# Altium project CommsBoard.PrjPcb
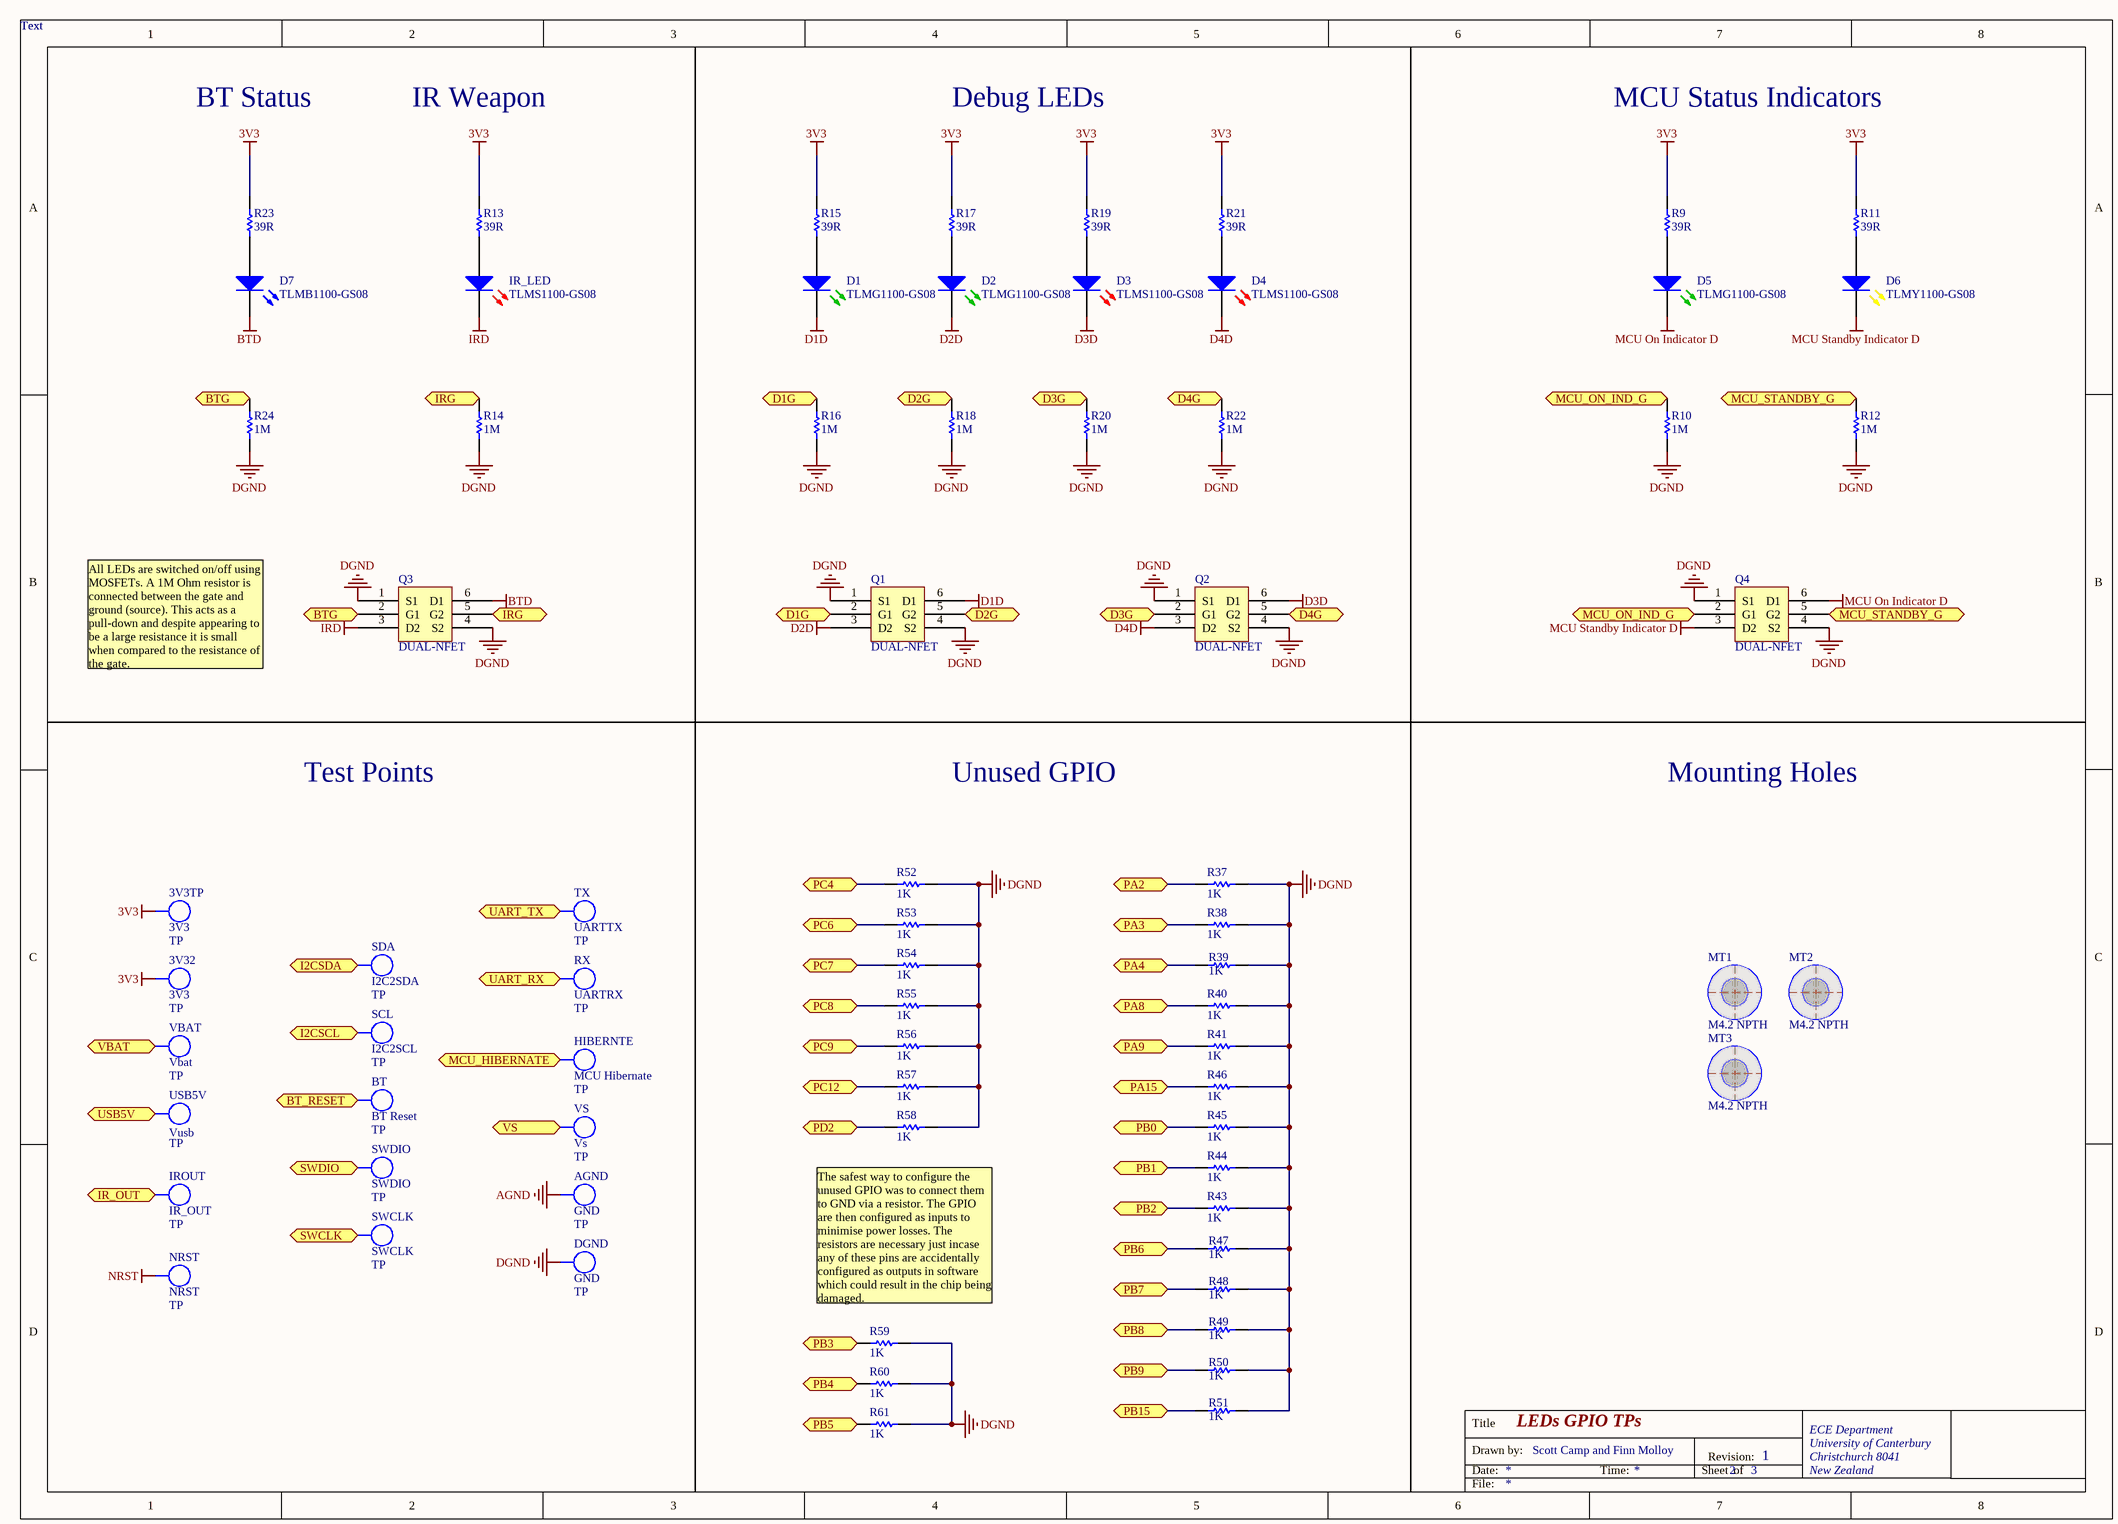
[diagram p0: Debug.SchDoc]
2 sheets, 111 parts. Net scope: flat (ports and power ports of the same name join across sheets).
Board file: CommsPCB.PcbDoc
Sheets:
  Debug.SchDoc
  Micro.SchDoc

## Sheet Debug.SchDoc: LEDs GPIO TPs
size A3; DrawnBy: Scott Camp and Finn Molloy; Address1: ECE Department; Address2: University of Canterbury; Address3: Christchurch 8041; Address4: New Zealand; Revision: 1; SheetNumber: 2; SheetTotal: 3

### Parts
3V3TP  3V3  value TP  [TEST_POINT_3.5X2MM]  (no BOM)
3V32  3V3  value TP  [TEST_POINT_3.5X2MM]  (no BOM)
AGND  GND  value TP  [TEST_POINT_3.5X2MM]  (no BOM)
BT  BT Reset  value TP  [TEST_POINT_3.5X2MM]  (no BOM)
D1  TLMG1100-GS08  [LED0.8X1.6]
D2  TLMG1100-GS08  [LED0.8X1.6]
D3  TLMS1100-GS08  [LED0.8X1.6]
D4  TLMS1100-GS08  [LED0.8X1.6]
D5  TLMG1100-GS08  [LED0.8X1.6]
D6  TLMY1100-GS08  [LED0.8X1.6]
D7  TLMB1100-GS08  [LED0.8X1.6]
DGND  GND  value TP  [TEST_POINT_3.5X2MM]  (no BOM)
HIBERNTE  MCU Hibernate  value TP  [TEST_POINT_3.5X2MM]  (no BOM)
IR_LED  TLMS1100-GS08  [LED0.8X1.6]
IROUT  IR_OUT  value TP  [TEST_POINT_3.5X2MM]  (no BOM)
MT1  M4.2 NPTH  [MNT-HOLE_4.2mm_NPTH]  (no BOM)
MT2  M4.2 NPTH  [MNT-HOLE_4.2mm_NPTH]  (no BOM)
MT3  M4.2 NPTH  [MNT-HOLE_4.2mm_NPTH]  (no BOM)
NRST  NRST  value TP  [TEST_POINT_3.5X2MM]  (no BOM)
Q1  DUAL-NFET  [SOT363-6N]
Q2  DUAL-NFET  [SOT363-6N]
Q3  DUAL-NFET  [SOT363-6N]
Q4  DUAL-NFET  [SOT363-6N]
R9  39R  [RESC1608L]
R10  1M  [RESC1608L]
R11  39R  [RESC1608L]
R12  1M  [RESC1608L]
R13  39R  [RESC1608L]
R14  1M  [RESC1608L]
R15  39R  [RESC1608L]
R16  1M  [RESC1608L]
R17  39R  [RESC1608L]
R18  1M  [RESC1608L]
R19  39R  [RESC1608L]
R20  1M  [RESC1608L]
R21  39R  [RESC1608L]
R22  1M  [RESC1608L]
R23  39R  [RESC1608L]
R24  1M  [RESC1608L]
R37  1K  [RESC1608L]
R38  1K  [RESC1608L]
R39  1K  [RESC1608L]
R40  1K  [RESC1608L]
R41  1K  [RESC1608L]
R43  1K  [RESC1608L]
R44  1K  [RESC1608L]
R45  1K  [RESC1608L]
R46  1K  [RESC1608L]
R47  1K  [RESC1608L]
R48  1K  [RESC1608L]
R49  1K  [RESC1608L]
R50  1K  [RESC1608L]
R51  1K  [RESC1608L]
R52  1K  [RESC1608L]
R53  1K  [RESC1608L]
R54  1K  [RESC1608L]
R55  1K  [RESC1608L]
R56  1K  [RESC1608L]
R57  1K  [RESC1608L]
R58  1K  [RESC1608L]
R59  1K  [RESC1608L]
R60  1K  [RESC1608L]
R61  1K  [RESC1608L]
RX  UARTRX  value TP  [TEST_POINT_3.5X2MM]  (no BOM)
SCL  I2C2SCL  value TP  [TEST_POINT_3.5X2MM]  (no BOM)
SDA  I2C2SDA  value TP  [TEST_POINT_3.5X2MM]  (no BOM)
SWCLK  SWCLK  value TP  [TEST_POINT_3.5X2MM]  (no BOM)
SWDIO  SWDIO  value TP  [TEST_POINT_3.5X2MM]  (no BOM)
TX  UARTTX  value TP  [TEST_POINT_3.5X2MM]  (no BOM)
USB5V  Vusb  value TP  [TEST_POINT_3.5X2MM]  (no BOM)
VBAT  Vbat  value TP  [TEST_POINT_3.5X2MM]  (no BOM)
VS  Vs  value TP  [TEST_POINT_3.5X2MM]  (no BOM)

### Ports
BT_RESET (bidir), BTG (bidir), D1G (bidir), D2G (bidir), D3G (bidir), D4G (bidir), I2CSCL (bidir), I2CSDA (bidir), IR_OUT (bidir), IRG (bidir), MCU_HIBERNATE (bidir), MCU_ON_IND_G (bidir), MCU_STANDBY_G (bidir), PA2 (bidir), PA3 (bidir), PA4 (bidir), PA8 (bidir), PA9 (bidir), PA15 (bidir), PB0 (bidir), PB1 (bidir), PB2 (bidir), PB3 (bidir), PB4 (bidir), PB5 (bidir), PB6 (bidir), PB7 (bidir), PB8 (bidir), PB9 (bidir), PB15 (bidir), PC4 (bidir), PC6 (bidir), PC7 (bidir), PC8 (bidir), PC9 (bidir), PC12 (bidir), PD2 (bidir), SWCLK (bidir), SWDIO (bidir), UART_RX (bidir), UART_TX (bidir), USB5V (bidir), VBAT (bidir), VS (bidir)

### Nets
3V3: 3V3TP.1 3V32.1 R9.2 R11.2 R13.2 R15.2 R17.2 R19.2 R21.2 R23.2
AGND: AGND.1
BTD: D7.2(K) Q3.6(D1)
D1D: D1.2(K) Q1.6(D1)
D2D: D2.2(K) Q1.3(D2)
D3D: D3.2(K) Q2.6(D1)
D4D: D4.2(K) Q2.3(D2)
DGND: DGND.1 Q1.1(S1) Q1.4(S2) Q2.1(S1) Q2.4(S2) Q3.1(S1) Q3.4(S2) Q4.1(S1) Q4.4(S2) R10.1 R12.1 R14.1 R16.1 R18.1 R20.1 R22.1 R24.1 R37.1 R38.1 R39.1 R40.1 R41.1 R43.1 R44.1 R45.1 R46.1 R47.2 R48.2 R49.2 R50.2 R51.1 R52.1 R53.1 R54.1 R55.1 R56.1 R57.1 R58.1 R59.1 R60.1 R61.1
IRD: IR_LED.2(K) Q3.3(D2)
MCU On Indicator D: D5.2(K) Q4.6(D1)
MCU Standby Indicator D: D6.2(K) Q4.3(D2)
NRST: NRST.1
NetBT_1: BT.1 ; port BT_RESET
NetC10_2: HIBERNTE.1 ; port MCU_HIBERNATE
NetD1_1: D1.1(A) R15.1
NetD2_1: D2.1(A) R17.1
NetD3_1: D3.1(A) R19.1
NetD4_1: D4.1(A) R21.1
NetD5_1: D5.1(A) R9.1
NetD6_1: D6.1(A) R11.1
NetD7_1: D7.1(A) R23.1
NetIR_LED_1: IR_LED.1(A) R13.1
NetIROUT_1: IROUT.1 ; port IR_OUT
NetP1_2: VBAT.1 ; port VBAT
NetP2_1: USB5V.1 ; port USB5V
NetProgram_2: SWCLK.1 ; port SWCLK
NetProgram_4: SWDIO.1 ; port SWDIO
NetQ1_2: Q1.2(G1) R16.2 ; port D1G
NetQ1_5: Q1.5(G2) R18.2 ; port D2G
NetQ2_2: Q2.2(G1) R20.2 ; port D3G
NetQ2_5: Q2.5(G2) R22.2 ; port D4G
NetQ3_2: Q3.2(G1) R24.2 ; port BTG
NetQ3_5: Q3.5(G2) R14.2 ; port IRG
NetQ4_2: Q4.2(G1) R10.2 ; port MCU_ON_IND_G
NetQ4_5: Q4.5(G2) R12.2 ; port MCU_STANDBY_G
NetR37_2: R37.2 ; port PA2
NetR38_2: R38.2 ; port PA3
NetR39_2: R39.2 ; port PA4
NetR40_2: R40.2 ; port PA8
NetR41_2: R41.2 ; port PA9
NetR43_2: R43.2 ; port PB2
NetR44_2: R44.2 ; port PB1
NetR45_2: R45.2 ; port PB0
NetR46_2: R46.2 ; port PA15
NetR47_1: R47.1 ; port PB6
NetR48_1: R48.1 ; port PB7
NetR49_1: R49.1 ; port PB8
NetR50_1: R50.1 ; port PB9
NetR51_2: R51.2 ; port PB15
NetR52_2: R52.2 ; port PC4
NetR53_2: R53.2 ; port PC6
NetR54_2: R54.2 ; port PC7
NetR55_2: R55.2 ; port PC8
NetR56_2: R56.2 ; port PC9
NetR57_2: R57.2 ; port PC12
NetR58_2: R58.2 ; port PD2
NetR59_2: R59.2 ; port PB3
NetR60_2: R60.2 ; port PB4
NetR61_2: R61.2 ; port PB5
NetRX_1: RX.1 ; port UART_RX
NetSCL_1: SCL.1 ; port I2CSCL
NetSDA_1: SDA.1 ; port I2CSDA
NetTX_1: TX.1 ; port UART_TX
NetVS_1: VS.1 ; port VS

### Notes on the sheet
- Text
- BT Status
- IR Weapon
- Debug LEDs
- MCU Status Indicators
- All LEDs are switched on/off using MOSFETs. A 1M Ohm resistor is connected between the gate and ground (source). This acts as a pull-down and despite appearing to be a large resistance it is small when compared to the resistance of the gate.
- Test Points
- Unused GPIO
- Mounting Holes
- The safest way to configure the unused GPIO was to connect them to GND via a resistor. The GPIO are then configured as inputs to minimise power losses. The resistors are necessary just incase any of these pins are accidentally configured as outputs in software which could result in the chip being damaged.
- Title
- Drawn by:
- Date:
- Time:
- Sheet
- Revision:
- of
- File:

### Library data of the parts
3V3TP 3V32 AGND BT DGND HIBERNTE IROUT NRST RX SCL SDA SWCLK SWDIO TX USB5V VBAT VS = TP_TESTPOINT: Test-Point SMD; Manufacturer PN: *; Manufacturer: *; Supplier 1: ECE Stock; Supplier Part Number 1: 5016KTR-ND; Storage Location: ProtoPlace
D1 D2 D5 = DL_TLMG1100: LED Green 0603; Manufacturer: Vishay Semiconductor Opto Division; Millicandela Rating: 35mcd; Voltage - Forward (Vf) Typ: 2.1V; Viewing Angle: 160°; Wavelength - Peak: 572nm; Supplier 1: Farnell; Supplier 2: Digi-Key; Color: Green; Package / Case: 0603 (1608 Metric); Packaging: Cut Tape (CT); Size / Dimension: 1.60mm L x 0.80mm W; Pricing: 1=0.67, 10=0.525, 25=0.4376, 100=0.359, 250=0.29912, 500=0.24852, 1000=0.18408 (NZD); Supplier Part Number 1: 2293494; Supplier Part Number 2: 751-1165-1-ND; Manufacturer Part Number: TLMG1100-GS08
D3 D4 IR_LED = DL_TLMS1100: LED Red 0603; Lens Style/Size: Rectangle with Flat Top, 1.6mm x 0.8mm; Millicandela Rating: 63mcd; Viewing Angle: 160°; Voltage - Forward (Vf) Typ: 2.1V; Wavelength - Dominant: 633nm; Supplier 1: Farnell; Supplier 2: Digi-Key; Package / Case: 0603 (1608 Metric); Size / Dimension: 1.60mm L x 0.80mm W; Pricing: 1=0.67, 10=0.525, 25=0.4376, 100=0.359, 250=0.29912, 500=0.24852, 1000=0.18408 (NZD); Supplier Part Number 1: 1440338; Supplier Part Number 2: 751-1182-1-ND; Manufacturer Part Number: TLMS1100-GS08
D6 = DL_TLMY1100: LED Yellow 0603; Manufacturer: Vishay Semiconductor Opto Division; Lens Style/Size: Rectangle with Flat Top, 1.6mm x 0.8mm; Millicandela Rating: 80mcd; Viewing Angle: 160°; Voltage - Forward (Vf) Typ: 2.1V; Wavelength - Peak: 591nm; Supplier 1: Farnell; Supplier 2: Digi-Key; Package / Case: 0603 (1608 Metric); Packaging: Cut Tape (CT); Size / Dimension: 1.60mm L x 0.80mm W; Pricing: 1=0.67, 10=0.525, 25=0.4376, 100=0.359, 250=0.29912, 500=0.24852, 1000=0.18408 (NZD); Supplier Part Number 1: 2103887; Supplier Part Number 2: 751-1186-1-ND; Manufacturer Part Number: TLMY1100-GS08
D7 = DL_TLMB1100: LED Blue 0603; Manufacturer: Vishay Semiconductor Opto Division; Lens Style/Size: Rectangle with Flat Top, 1.6mm x 0.8mm; Millicandela Rating: 5mcd; Viewing Angle: 160°; Voltage - Forward (Vf) Typ: 3.9V; Wavelength - Peak: 428nm; Supplier 1: Farnell; Supplier 2: Digi-Key; Package / Case: 0603 (1608 Metric); Packaging: Cut Tape (CT); Size / Dimension: 1.60mm L x 0.80mm W; Pricing: 1=1.51, 10=1.341, 25=1.184, 100=1.0656, 250=0.92748, 500=0.82882, 1000=0.65121 (NZD); Supplier Part Number 1: 1328305; Supplier Part Number 2: 751-1156-1-ND; Manufacturer Part Number: TLMB1100-GS08
MT1-MT3 = MC_M4.2_HOLE_NPT: Fixing M4.2 Mount Hole NPTH; Manufacturer: Hi-Q; Manufacturer PN: 4NE Series M4 Clearance; price: 0; value: M4.2 NPTH
R9 R11 R13 R15 R17 R19 R21 R23 = RS_39R: RES 39 OHM 1/10W 5% 0603 SMD; Storage Location: ProtoPlace; Supplier: ECE Dept Stock; Value: 39R
R10 R12 R14 R16 R18 R20 R22 R24 = RS_1M: RES 1.0M OHM 1/10W 5% 0603 SMD; Storage Location: ProtoPlace  Red Pottel; Supplier: ECE Dept Stock; Value: 1M
R37-R41 R43-R61 = RS_1K: RES 1.0K OHM 1/10W 5% 0603 SMD; Storage Location: ProtoPlace; Supplier: ECE Dept Stock; Value: 1K

## Sheet Micro.SchDoc: Comms Board Power
size A3; DrawnBy: Scott Camp and Finn Molloy; Address1: ECE Department; Address2: University of Canterbury; Address3: Christchurch 8041; Address4: New Zealand; Revision: 1; SheetNumber: 3; SheetTotal: 3
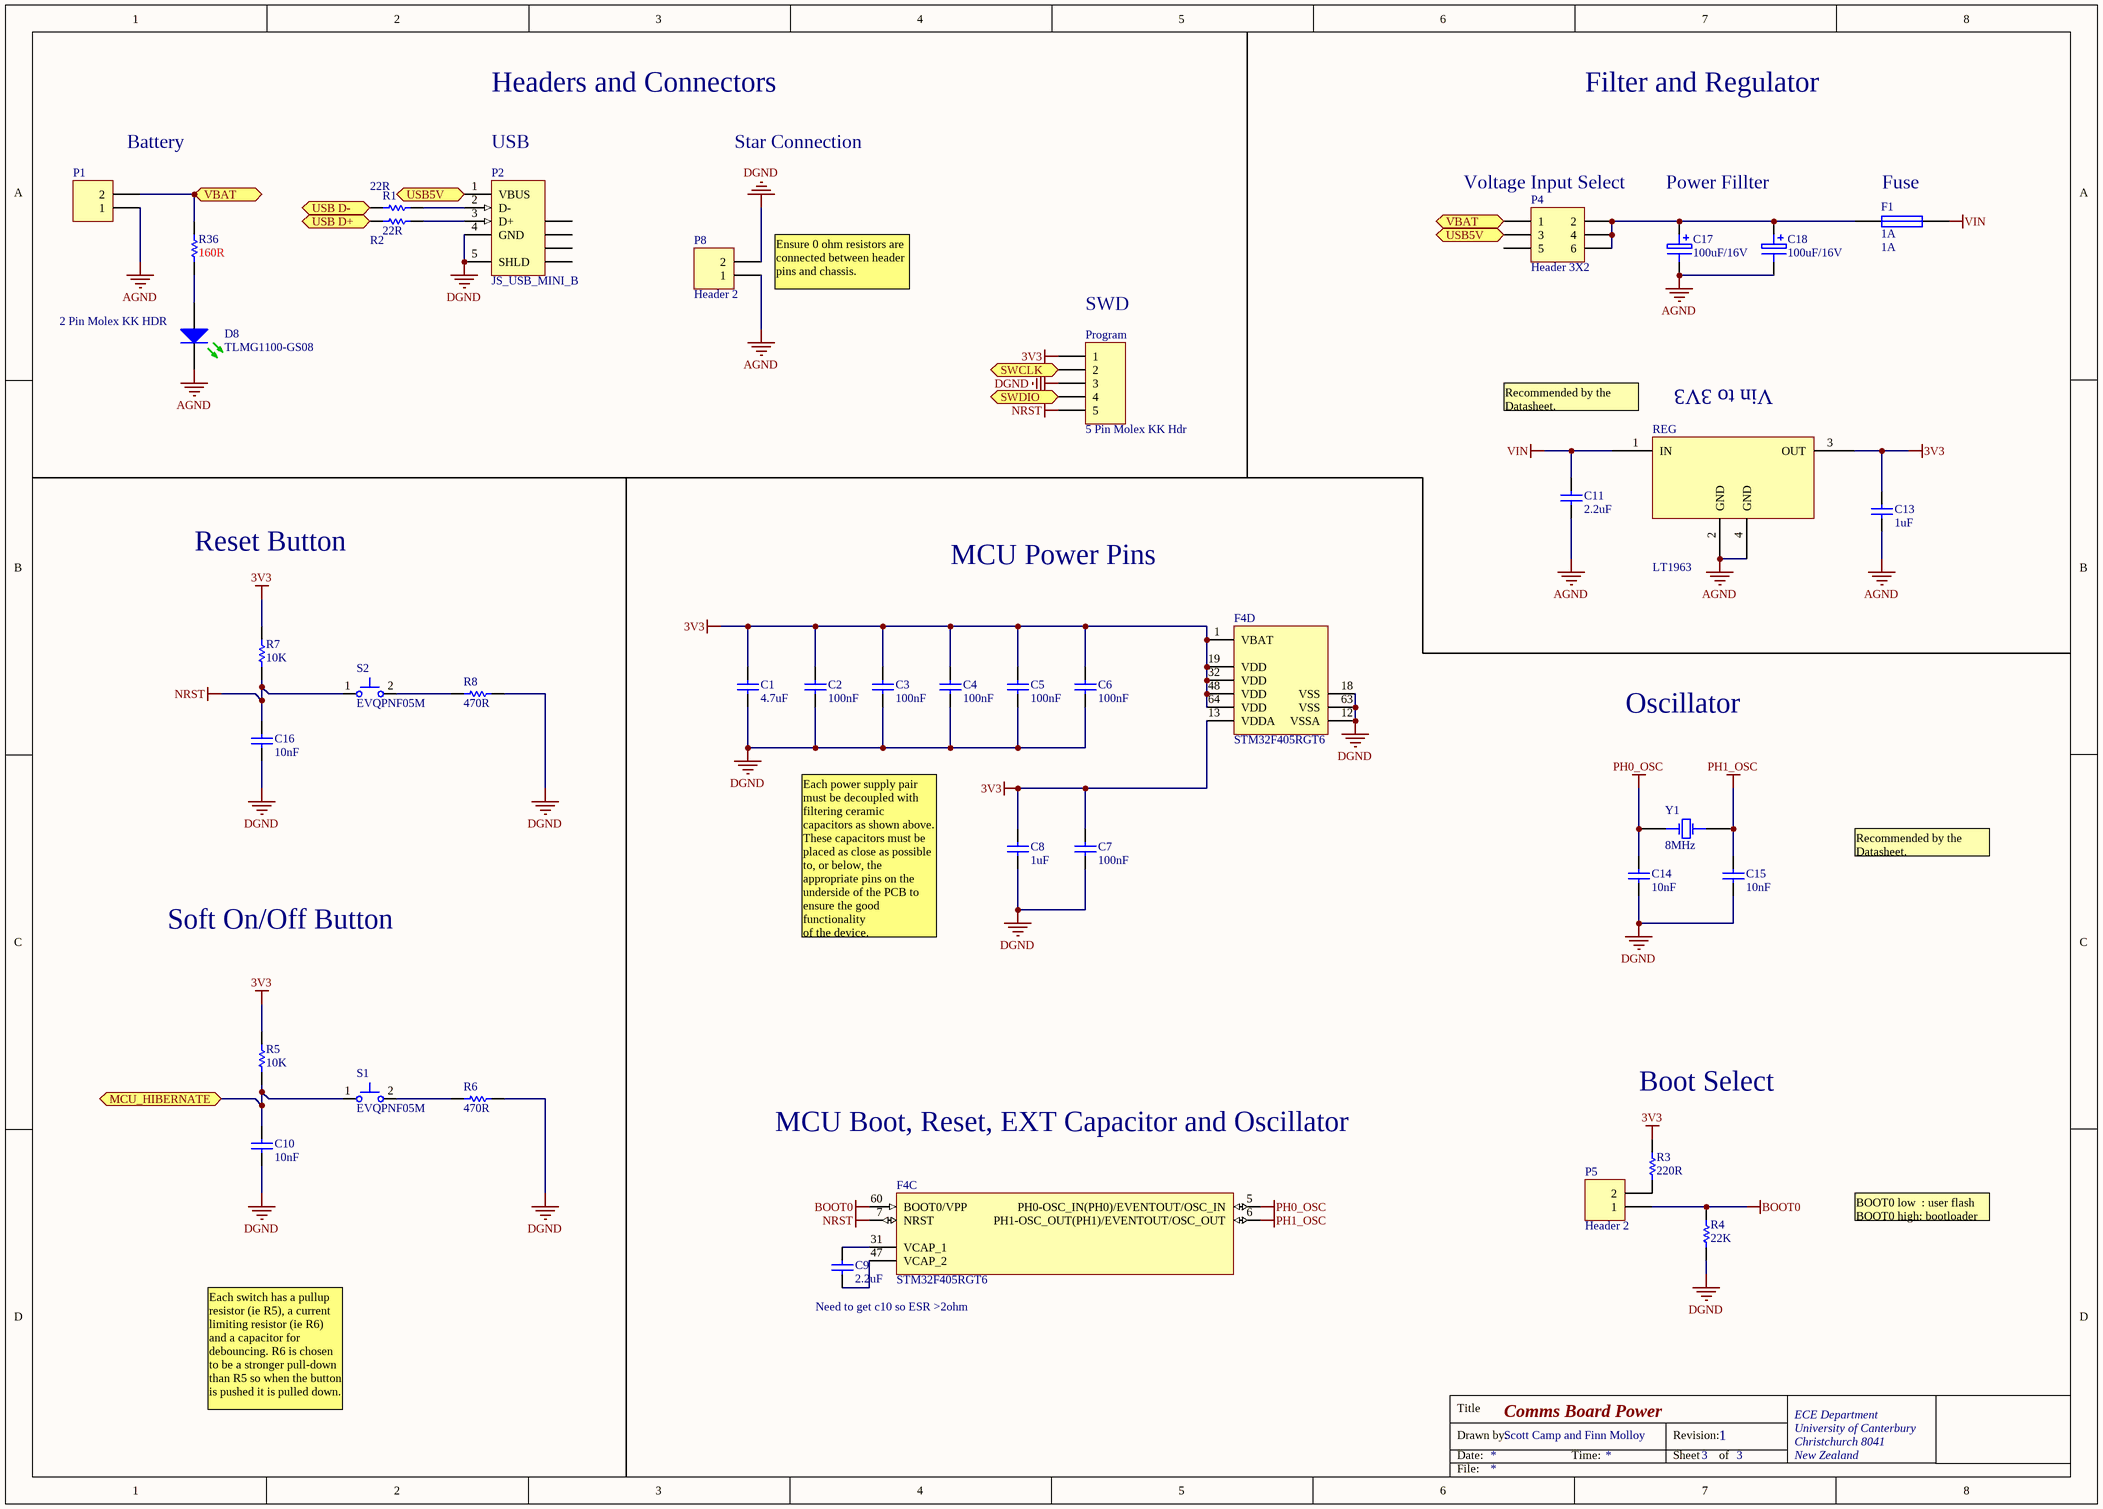
[diagram p1: Micro.SchDoc]

### Parts
C1  4.7uF  [CAPC2012L]
C2  100nF  [CAPC1005L]
C3  100nF  [CAPC1005L]
C4  100nF  [CAPC1005L]
C5  100nF  [CAPC1005L]
C6  100nF  [CAPC1005L]
C7  100nF  [CAPC1005L]
C8  1uF  [CAPC1608L]
C9  2.2uF  [CAPC2012L]
C10  10nF  [CAPC1608L]
C11  2.2uF  [CAPC2012L]
C13  1uF  [CAPC1608L]
C14  10nF  [CAPC1608L]
C15  10nF  [CAPC1608L]
C16  10nF  [CAPC1608L]
C17  100uF/16V  [NICH-1]
C18  100uF/16V  [NICH-1]
D8  TLMG1100-GS08  [LED0.8X1.6]
F1  1A  [RESC3216N]
F4  STM32F405RGT6  [TQFP64_V]  (parts C,D of 4)
P1  2 Pin Molex KK HDR  [MOLEX_KK_2_HDR]
P2  JS_USB_MINI_B  [USB/SM0.8-6H5]
P4  Header 3X2  [HDR2X3]
P5  Header 2  [HDR1X2]
P8  Header 2  [HDR1X2]
Program  5 Pin Molex KK Hdr  [MOLEX_KK_5_HDR]
R1  22R  [RESC1608L]
R2  22R  [RESC1608L]
R3  220R  [RESC1608L]
R4  22K  [RESC1608L]
R5  10K  [RESC1608L]
R6  470R  [RESC1608L]
R7  10K  [RESC1608L]
R8  470R  [RESC1608L]
R36  160R  [RESC1608L]
REG  LT1963  [SOT223-4M]
S1  EVQPNF05M  [EVQPNF05M]
S2  EVQPNF05M  [EVQPNF05M]
Y1  8MHz  [HC49/4h_SMX]

### Ports
MCU_HIBERNATE (bidir), SWCLK (bidir), SWDIO (bidir), USB5V (bidir), USB D+ (bidir), USB D- (bidir), VBAT (bidir)

### Nets
3V3: C1.2 C2.2 C3.2 C4.2 C5.2 C6.2 C7.2 C8.2 C13.2 F4.1(VBAT) F4.13(VDDA) F4.19(VDD) F4.32(VDD) F4.48(VDD) F4.64(VDD) Program.1 R3.2 R5.2 R7.2 REG.3(OUT)
AGND: C11.2 C13.1 C17.1 C18.1 D8.2(K) P1.1 P8.1 REG.2(GND) REG.4(GND)
BOOT0: F4.60(BOOT0/VPP) P5.1 R4.2
DGND: C1.1 C2.1 C3.1 C4.1 C5.1 C6.1 C7.1 C8.1 C10.1 C14.1 C15.1 C16.1 F4.12(VSSA) F4.18(VSS) F4.63(VSS) P2.4(GND) P2.5(SHLD) P8.2 Program.3 R4.1 R6.2 R8.2
NRST: C16.2 F4.7(NRST) Program.5 R7.1 S2.1
PH0_OSC: C14.2 F4.5(PH0-OSC_IN(PH0)/EVENTOUT/OSC_IN) Y1.1(OSC1)
PH1_OSC: C15.2 F4.6(PH1-OSC_OUT(PH1)/EVENTOUT/OSC_OUT) Y1.2(OSC2)
VIN: C11.1 F1.2 REG.1(IN)
NetC9_1: C9.1 F4.31(VCAP_1)
NetC9_2: C9.2 F4.47(VCAP_2)
NetC10_2: C10.2 R5.1 S1.1 ; port MCU_HIBERNATE
NetC17_2: C17.2 C18.2 F1.1 P4.2 P4.4 P4.6
NetD8_1: D8.1(A) R36.1
NetP1_2: P1.2 P4.1 R36.2 ; port VBAT
NetP2_1: P2.1(VBUS) P4.3 ; port USB5V
NetP2_2: P2.2(D-) R1.2
NetP2_3: P2.3(D+) R2.2
NetP5_2: P5.2 R3.1
NetProgram_2: Program.2 ; port SWCLK
NetProgram_4: Program.4 ; port SWDIO
NetR1_1: R1.1 ; port USB D-
NetR2_1: R2.1 ; port USB D+
NetR6_1: R6.1 S1.2
NetR8_1: R8.1 S2.2

Not connected (* = marked no-connect by the designer): P2 6(SHLD) 7(SHLD) 8(SHLD) 9(SHLD); P4 5

### Notes on the sheet
- Headers and Connectors
- Filter and Regulator
- (near P1) Battery
- (near P2) USB
- Star Connection
- (near P4) Voltage Input Select
- Power Fillter
- (near F1) Fuse
- (near P8) Ensure 0 ohm resistors are connected between header pins and chassis.
- (near Program) SWD
- (near REG) Vin to 3V3
- (near REG) Recommended by the Datasheet.
- Reset Button
- MCU Power Pins
- Oscillator
- Recommended by the Datasheet.
- Soft On/Off Button
- Each power supply pair must be decoupled with filtering ceramic capacitors as shown above. These capacitors must be
  placed as close as possible to, or below, the appropriate pins on the underside of the PCB to ensure the good functionality
  of the device.
- Boot Select
- MCU Boot, Reset, EXT Capacitor and Oscillator
- BOOT0 low  : user flash
  BOOT0 high: bootloader
- Need to get c10 so ESR >2ohm
- Each switch has a pullup resistor (ie R5), a current limiting resistor (ie R6) and a capacitor for debouncing. R6 is chosen to be a stronger pull-down than R5 so when the button is pushed it is pulled down.
- Title
- Drawn by:
- Date:
- Time:
- Revision:
- Sheet
- of
- File:

### Library data of the parts
C1 = CC_4.7uF_0805: CAP CER 4.7uF Y5V -20% +80% 16V 0805; Note: Footprint corresponds to dimensions for bulk cassette packaging. This case size has tightened tolerances.; PackageReference: 0805; Code_IPC: 2012[0805]; Verify: *; Supplier: ECE Dept Stock; Storage Location: Pottle; Value: 4.7uF
C2-C7 = CC_100nF_0402: CAP CER 100nF X7R +-10% 16V 0402; PackageReference: 0402; Code_IPC: 1005 [0402]; Verify: *; Supplier: ECE Dept Stock; Storage Location: Pottle; Value: 100nF
C8 C13 = CC_1uF_0603: CAP CER 1uF Y5V -20% +80% 16V 0603; PackageReference: 0603; Code_IPC: 1608 [0603]; Verify: *; Supplier: ECE Dept Stock; Storage Location: Pottle; Value: 1uF
C9 C11 = CC_2.2uF_0805: CAP CER 2.2uF Y5V -20% +80% 25V 0805; Note: Footprint corresponds to dimensions for bulk cassette packaging. This case size has tightened tolerances.; PackageReference: 0805; Code_IPC: 2012[0805]; Verify: *; Supplier: ECE Dept Stock; Storage Location: Pottle; Value: 2.2uF
C10 C14-C16 = CC_10nF_0603: CAP CER 10nF X7R +-10% 50V 0603; PackageReference: 0603; Code_IPC: 1608 [0603]; Verify: *; Supplier: ECE Dept Stock; Storage Location: Pottle; Value: 10nF
C17 C18 = CA_100uF_16V_SMD: Nichcon WX series  SMT Aluminium Electrolytic Cap; Manufacturer PN: UWX1C101MCL1GB; Value: 100uF @ 16V; Manufacturer: Nichcon; Supplier 1: ECE Stock
D8 = DL_TLMG1100: as D1 on sheet Debug; Supplier 1: Farnell; Supplier 2: Digi-Key; Color: Green; Package / Case: 0603 (1608 Metric); Packaging: Cut Tape (CT); Size / Dimension: 1.60mm L x 0.80mm W; Pricing: 1=0.67, 10=0.525, 25=0.4376, 100=0.359, 250=0.29912, 500=0.24852, 1000=0.18408 (NZD); Supplier Part Number 1: 2293494; Supplier Part Number 2: 751-1165-1-ND; Manufacturer Part Number: TLMG1100-GS08
F1 = FS_Fuse_1.0A_SMD_1206: Fuse 1.0A Very Fast Acting 1206; Manufacturer: Multicomp; Manufacturer PN: MC12CF 001; Supplier: Lab Stock; Storage Location: *; Value: 1A
F4 = STM32F405RGT6: ARM Cortex-M4 32b MCU+FPU, 210DMIP, 1024 kB Flash, 192+4 kB RAM, 51 I/Os, 64-pin LQFP, -40 to +85°C, Tray; Internal RAM: 192kB; Operating Frequency (Processor Speed): 168MHz; A/D Converter: 16x12-bit; D/A Converter: 2x12-bit; 16-bit Timers (IC/OC/PWM): 12x16-bit(24/24/30); 32-bit Timer (IC/OC/PWM): 2x32-bit (8/8/8); Other Timer Functions: 2xWDG, RTC, 24-bit down counter; Serial Interface: 3xSPI/2xI2S/2xI2C/3xUSART(IrDa, ISO7816)/3xUART/1xUSB OTG FS/HS, 2xCAN/ SDIO; DatasheetVersion: rev2, Jan-2012; PackageVersion: 2012; PackageReference: TQFP64; PackageDescription: 64-Pin Low Profile Quad Flat Package, 10x10 mm Body, 0.5 mm Pitch; ComponentLink1Description: Manufacturer URL; ComponentLink1URL: http://www.st.com/; ComponentLink2Description: STM32F405/7 Datasheet; ComponentLink2URL: http://www.st.com/internet/com/TECHNICAL_RESOURCES/TECHNICAL_LITERATURE/DATASHEET/DM00037051.pdf; ComponentLink3Description: STM32F4 Web Page; ComponentLink3URL: http://www.st.com/internet/mcu/subclass/1521.jsp
P1 = JA_MOLEX_KK_2POS: CONN HEADER 2POS 2.54mm VERT_Thru Hole; Supplier 1: Farnell; Supplier Part Number 1: 1462926; Supplier 2: ECE Store; Value: 2 Pin Molex KK HDR
P2 = JS_USB_MINI_B_SMT: USB 2.0, Right Angle, SMT, B Type, Receptacle, 5 Position,; Manufacturer: FCI; Manufacturer PN: 10033526-N3212MLF; Supplier 1: Farnell; Supplier Part Number 1: 1824416; Supplier 2: ECE Stock
P4 = Header 3X2: Header, 3-Pin, Dual row; LatestRevisionDate: 17-Jul-2002; LatestRevisionNote: Re-released for DXP Platform.; Publisher: Altium Limited
P5 P8 = Header 2: Header, 2-Pin; LatestRevisionDate: 17-Jul-2002; LatestRevisionNote: Re-released for DXP Platform.; Publisher: Altium Limited
Program = JA_MOLEX_KK_5POS: CONN HEADER 5POS 2.54mm VERT_Thru Hole; Manufacturer: Molex; Manufacturer PN: 22-23-2051; Supplier 1: ECE Dept Store; Value: 5 Pin Molex KK Hdr
R1 R2 = RS_22R: RES 22 OHM 1/10W 5% 0603 SMD; Storage Location: ProtoPlace; Supplier: ECE Dept Stock; Value: 22R
R3 = RS_220R: RES 220 OHM 1/10W 5% 0603 SMD; Storage Location: ProtoPlace; Supplier: ECE Dept Stock; Value: 220R
R4 = RS_22K: RES 22.0K OHM 1/10W 5% 0603 SMD; Storage Location: ProtoPlace; Supplier: ECE Dept Stock; Value: 22K
R5 R7 = RS_10K: RES 10.0K OHM 1/10W 5% 0603 SMD; Storage Location: ProtoPlace; Supplier: ECE Dept Stock; Value: 10K
R6 R8 = RS_470R: RES 470 OHM 1/10W 5% 0603 SMD; Storage Location: ProtoPlace; Supplier: ECE Dept Stock; Value: 470R
R36 = RS_160R: RES 160 OHM 1/10W 5% 0603 SMD; Storage Location: Red Pottel; Supplier: ECE Dept Stock; Value: 160R
S1 S2 = WS_EVQPNF05M: Panasonic 6 x 3.5mm SMD Light Touch Switch Type; PackageDescription: 6.0 x 3.5 mm; Supplier 1: Farnell; Supplier Part Number 1: 2079481; Manufacturer: Panasonic; Manufacturer PN: EVQPNF05M
Y1 = XT_8MHz_HC49/4H: CRYSTAL 8.00 MHZ 18PF SMD; Manufacturer: Abracon Corporation; Manufacturer PN: ABLS-8.000MHZ-B2-T; Supplier 1: Digi-Key; Supplier Part Number 1: 535-9089-6-ND; Value: 8MHz

## Nets that join several sheets
3V3: Debug (10 pins), Micro (20 pins)
AGND: Debug (AGND.1), Micro (9 pins)
DGND: Debug (41 pins), Micro (22 pins)
NRST: Debug (NRST.1), Micro (5 pins)
NetC10_2: Debug (HIBERNTE.1), Micro (C10.2 R5.1 S1.1)
NetP1_2: Debug (VBAT.1), Micro (P1.2 P4.1 R36.2)
NetP2_1: Debug (USB5V.1), Micro (P2.1 P4.3)
NetProgram_2: Debug (SWCLK.1), Micro (Program.2)
NetProgram_4: Debug (SWDIO.1), Micro (Program.4)